# EAGLE design RF1_RS485 (EAGLE 7.1.0)
RS485/Renard adapter for the RF1
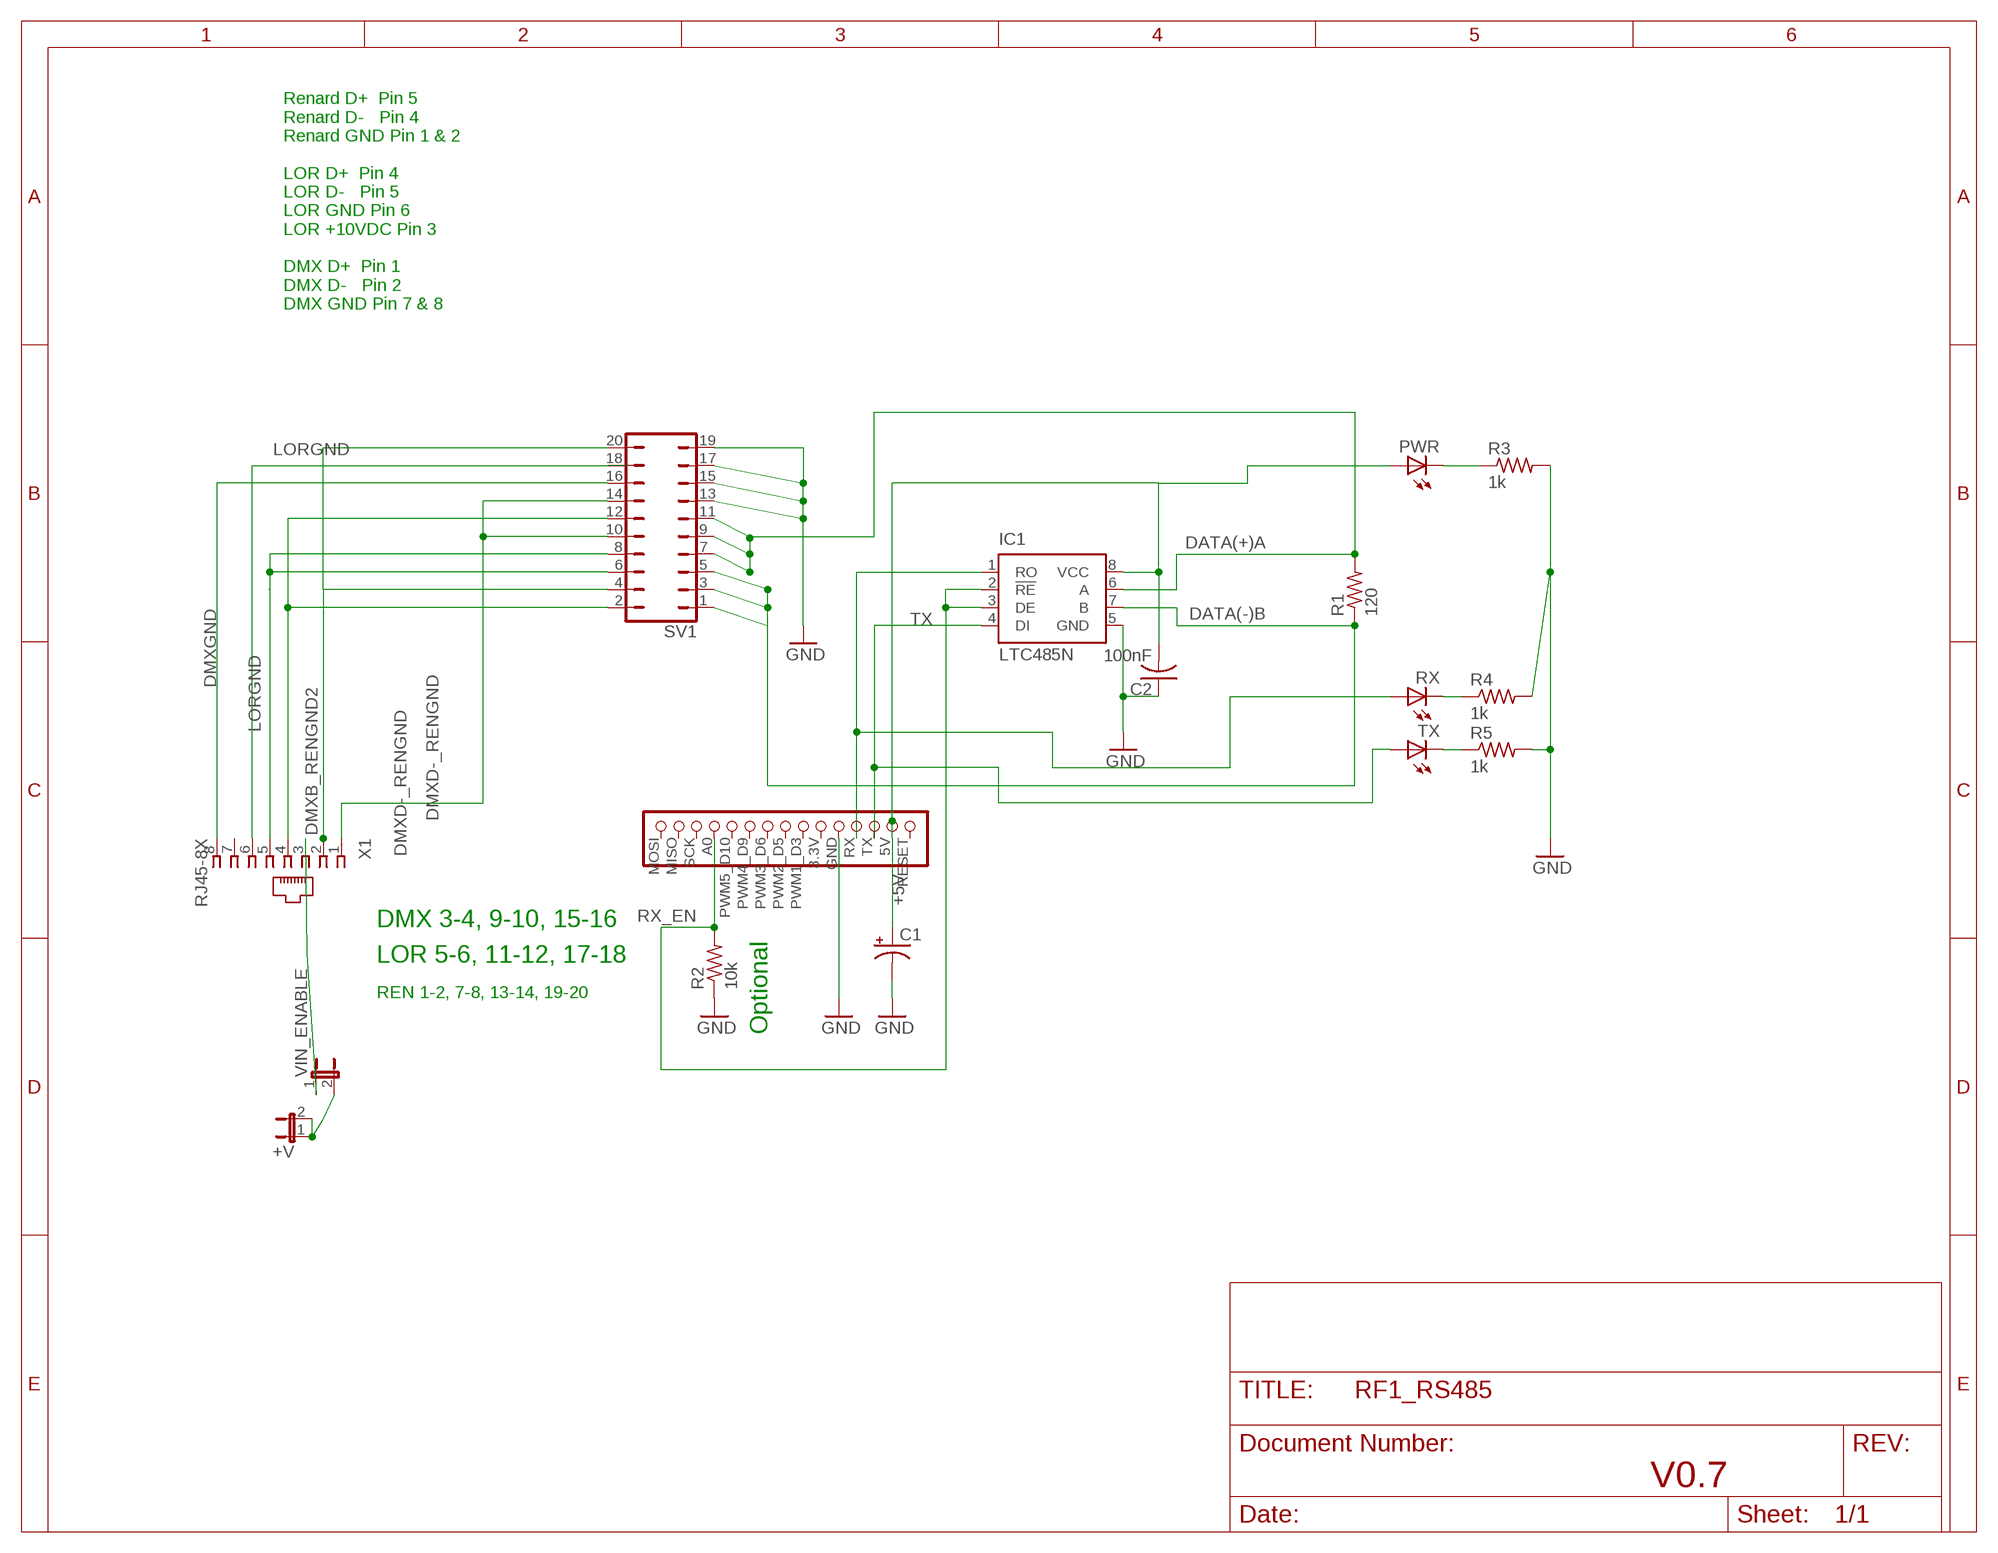
[diagram p0: schematic, sheet 1]

## Parts
+V  JP1E  [JP1]
C1  CPOL-USE5-5  [E5-5]
C2  100nF  C-US025-024X044  [C025-024X044]
IC1  LTC485N  [DIL08]
PWR  LED3MM  [LED3MM]
R1  120  R-US_0204/7  [0204/7]
R2  10k  R-US_0204/7  [0204/7]
R3  1k  R-US_0204/7  [0204/7]
R4  1k  R-US_0204/7  [0204/7]
R5  1k  R-US_0204/7  [0204/7]
RX  LED3MM  [LED3MM]
SV1  JP10Q  [JP10Q]
TX  LED3MM  [LED3MM]
U$1  RF1_HEADER_LEFT  [RF1_LEFTHEADER_ONLY]
VIN_ENABLE  JP1E  [JP1]
X1  RJ45-8X  [RJ45-NO-SHIELD]

## Nets
+5V: C1.+ C2.2 IC1.8(VCC) PWR.A U$1.5V
DATA(+)A: IC1.6(A) R1.2 SV1.7 SV1.9 SV1.11
DATA(-)B: IC1.7(B) R1.1 SV1.1 SV1.3 SV1.5
DMXB_RENGND2: SV1.4 SV1.20 X1.2
DMXD-_RENGND: SV1.10 SV1.14 X1.1
DMXGND: SV1.16 X1.8
GND: C1.- C2.1 IC1.5(GND) R2.1 R3.2 R4.2 R5.2 SV1.13 SV1.15 SV1.17 SV1.19 U$1.GND
LORGND: SV1.18 X1.6
N$1: SV1.6 SV1.8 X1.5
N$3: SV1.2 SV1.12 X1.4
N$5: VIN_ENABLE.1 X1.3
N$6: +V.1 +V.2 VIN_ENABLE.2
N$7: PWR.K(C) R3.1
N$8: R4.1 RX.K(C)
N$9: R5.1 TX.K(C)
RX: IC1.1(RO) RX.A U$1.RX
RX_EN: IC1.2(!RE) IC1.3(DE) R2.2 U$1.A0(PC0)
TX: IC1.4(DI) TX.A U$1.TX
Unconnected: U$1.3.3V U$1.MISO U$1.MOSI U$1.PWM1_D3(PWM1) U$1.PWM2_D5(PWM2) U$1.PWM3_D6(PWM3) U$1.PWM4_D9(PWM4) U$1.PWM5_D10(PWM5) U$1.RESET U$1.SCK X1.7

## Notes on the sheet
- Renard D+  Pin 5
  Renard D-   Pin 4
  Renard GND Pin 1 & 2
  
  LOR D+  Pin 4
  LOR D-   Pin 5
  LOR GND Pin 6
  LOR +10VDC Pin 3
  
  DMX D+  Pin 1
  DMX D-   Pin 2
  DMX GND Pin 7 & 8
- DMX 3-4, 9-10, 15-16
- LOR 5-6, 11-12, 17-18
- REN 1-2, 7-8, 13-14, 19-20
- Optional
- V0.7

## Library data of the parts
+V VIN_ENABLE = jumper:JP1E: JUMPER
C1 = adafruit:CPOL-US: POLARIZED CAPACITOR, American symbol
C2 = adafruit:C-US: CAPACITOR, American symbol
IC1 = linear-technology:LTC485: Low Power RS485 Interface Transceiver Source: http://www.linear.com/pc/downloadDocument.do?navId=H0,C1,C1007,C1017,P2064,D1718; OC_FARNELL: unknown; OC_NEWARK: unknown
PWR RX TX = adafruit:LED: LED OSRAM: - CHIPLED LG R971, LG N971, LY N971, LG Q971, LY Q971, LO R971, LY R971 LH N974, LH R974 LS Q976, LO Q976, LY Q976 LO Q996 - Hyper CHIPLED LW Q18S LB Q993, LB Q99A, LB R99A - SideLED LS A670, LO A670, LY A670, LG A670, LP A670 LB A673, LV A673, LT A673, LW A673 LH A674 LY A675 LS A676, LA A676, LO A676, LY A676, LW A676 LS A679, LY A679, LG A679 - Hyper Micro SIDELED® LS Y876, LA Y876, LO Y876, LY Y876 LT Y87S - SmartLED LW L88C, LW L88S LB L89C, LB L89S, LG L890 LS L89K, LO L89K, LY L89K LS L896, LA L896, LO L896, LY L896 - TOPLED LS T670, LO T670, LY T670, LG T670, LP T670 LSG T670, LSP T670, LSY T670, LOP T670, LYG T670 LG T671, LOG T671, LSG T671 LB T673, LV T673, LT T673, LW T673 LH T674 LS T676, LA T676, LO T676, LY T676, LB T676, LH T676, LSB T676, LW T676 LB T67C, LV T67C, LT T67C, LS T67K, LO T67K, LY T67K, LW E67C LS E67B, LA E67B, LO E67B, LY E67B, LB E67C, LV E67C, LT E67C LW T67C LS T679, LY T679, LG T679 LS T770, LO T770, LY T770, LG T770, LP T770 LB T773, LV T773, LT T773, LW T773 LH T774 LS E675, LA E675, LY E675, LS T675 LS T776, LA T776, LO T776, LY T776, LB T776 LHGB T686 LT T68C, LB T68C - Hyper Mini TOPLED® LB M676 - Mini TOPLED Santana® LG M470 LS M47K, LO M47K, LY M47K Source: http://www.osram.convergy.de/
R1-R5 = adafruit:R-US_: RESISTOR, American symbol
SV1 = jumper:JP10Q: JUMPER
U$1 = komby1:RF1_HEADER_LEFT
X1 = con-tycoelectronics_komby:RJ45: CORCOM Modular RJ Jacks No Shield Source: www.tycoelectronics.com .. ENG_DS_1654001_1099_RJ_L_0507.pdf; MPN: RJ45-8X; OC_FARNELL: unknown; OC_NEWARK: 16R6101

## Board
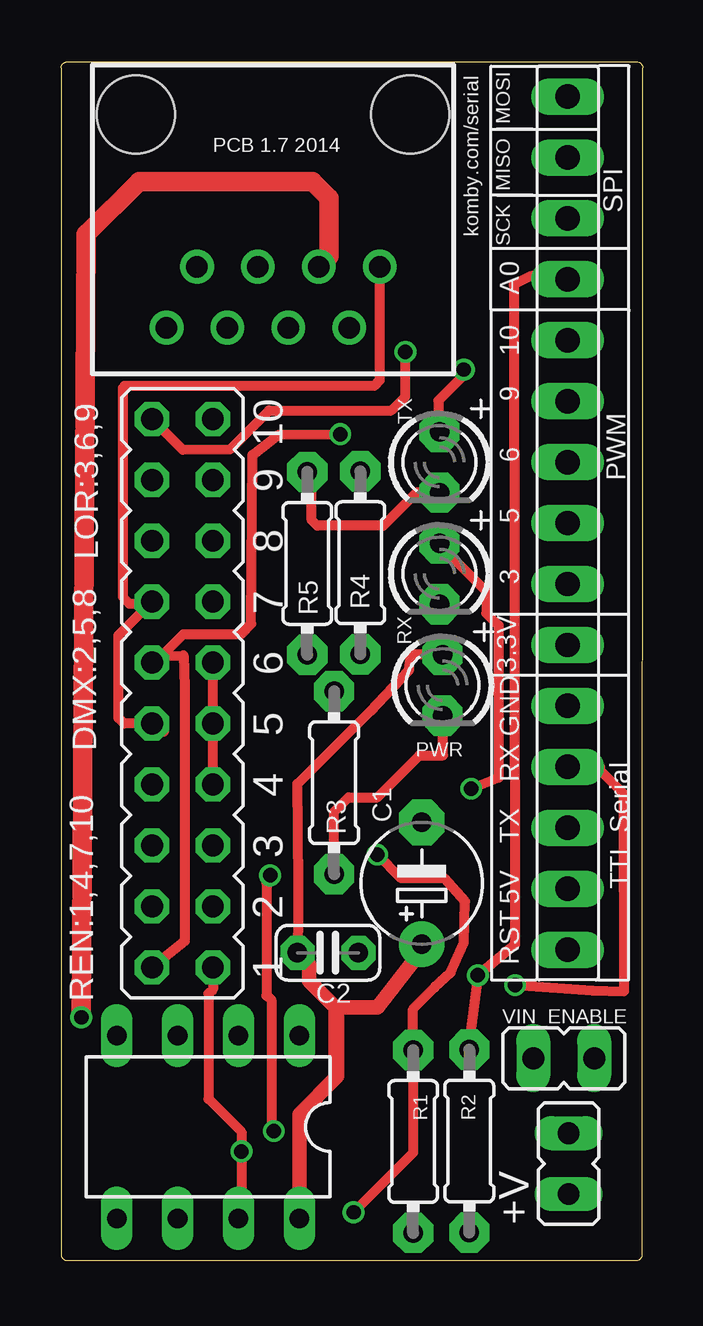
[diagram p1: board, top side]
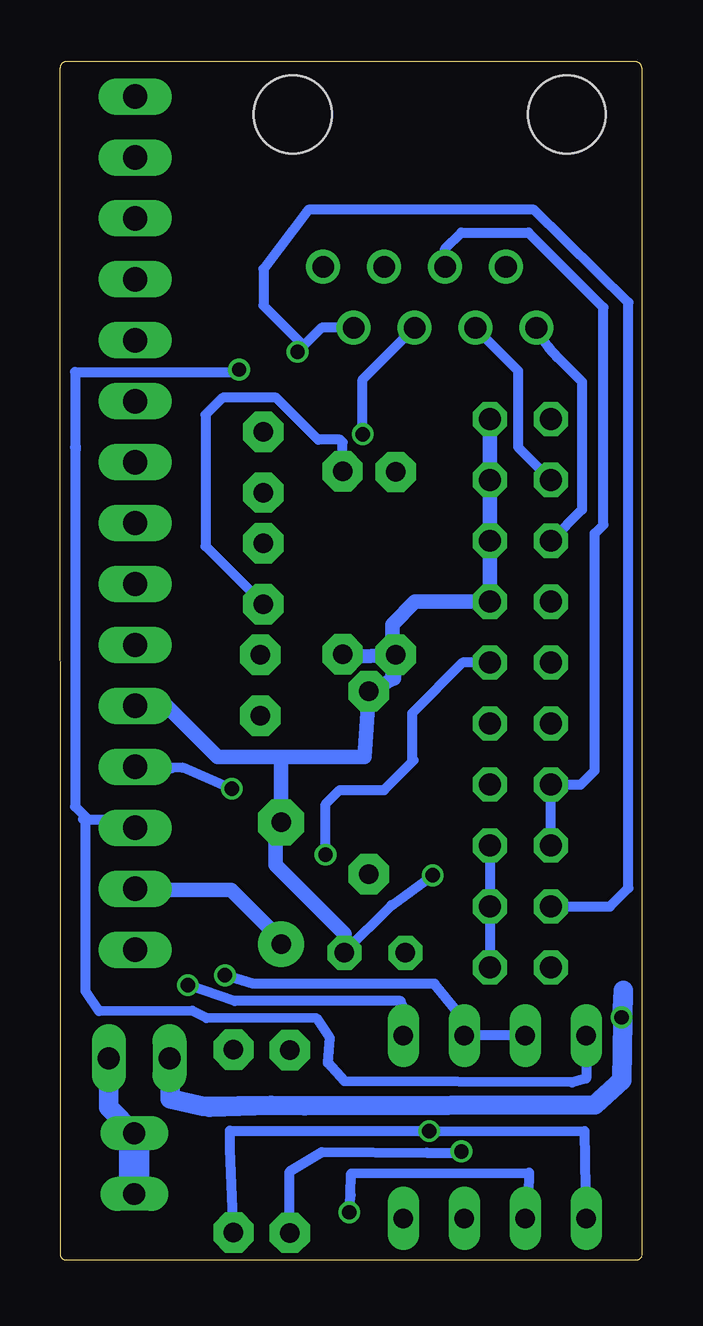
[diagram p2: board, bottom side, seen from below]

Size 24.26 x 49.96 mm. Coordinates in mm from the lower left corner, seen from the top.
Outline: 0,49.71 0,0.25 arc90 0.25,0 23.98,0 arc90 24.23,0.25 24.26,49.71 arc90 24,49.96 0.25,49.96 arc90 0,49.71
Copper layers (1*16): Top 0.035mm / dielectric 1.5mm / Bottom 0.035mm
Design rules "Elecrow_2-layer_eagle_rule": minimum track width 6mil, minimum drill 12mil, track to track 6mil, track to pad 6mil, pad to pad 6mil, via to via 6mil, smd to smd 0mil, copper to edge 10mil, drill to drill 10mil, minimum pad ring 10mil, minimum via ring 6mil, stop-mask expansion 2mil, vias tented up to drill 100mil, thermal gap 10mil

### Footprints (pad centres in the part's own frame; a part is rotated, then mirrored left to right if it is on the bottom)
JP1 = drill 0.914 long: 1 0,-1.27; 2 0,1.27
E5-5 = drill 0.813 pad 1.905: + -2.54,0 | drill 0.813 pad 1.905 octagon: - 2.54,0
C025-024X044 = drill 0.813 pad 1.422 octagon: 1 -1.27,0; 2 1.27,0
DIL08 = drill 0.813 long: 1 -3.81,-3.81; 2 -1.27,-3.81; 3 1.27,-3.81; 4 3.81,-3.81; 5 3.81,3.81; 6 1.27,3.81; 7 -1.27,3.81; 8 -3.81,3.81
LED3MM = drill 0.813 pad 1.676 octagon: A -1.27,0; K 1.27,0
0204/7 = drill 0.813 pad 1.676 octagon: 1 -3.81,0; 2 3.81,0
JP10Q = drill 0.914 octagon: 1 -11.43,-1.27; 2 -11.43,1.27; 3 -8.89,-1.27; 4 -8.89,1.27; 5 -6.35,-1.27; 6 -6.35,1.27; 7 -3.81,-1.27; 8 -3.81,1.27; 9 -1.27,-1.27; 10 -1.27,1.27; 11 1.27,-1.27; 12 1.27,1.27; 13 3.81,-1.27; 14 3.81,1.27; 15 6.35,-1.27; 16 6.35,1.27; 17 8.89,-1.27; 18 8.89,1.27; 19 11.43,-1.27; 20 11.43,1.27
RF1_LEFTHEADER_ONLY = drill 1.016 long: 3.3V 1.42,-5.215; 5V 1.42,-15.375; A0 1.42,10.025; GND 1.42,-7.755; MISO 1.42,15.105; MOSI 1.42,17.645; PWM1_D3 1.42,-2.675; PWM2_D5 1.42,-0.135; PWM3_D6 1.42,2.405; PWM4_D9 1.42,4.945; PWM5_D10 1.42,7.485; RESET 1.42,-17.915; RX 1.42,-10.295; SCK 1.42,12.565; TX 1.42,-12.835
RJ45-NO-SHIELD = drill 0.9 pad 1.4: 1 -4.445,6.35; 2 -3.175,8.89; 3 -1.905,6.35; 4 -0.635,8.89; 5 0.635,6.35; 6 1.905,8.89; 7 3.175,6.35; 8 4.445,8.89 | hole 3.251: -5.715,0; 5.715,0

### Placement (x,y rotation side)
+V  21.16,4.04 0 top
C1  15.04,15.72 90 top
C2  11.13,12.83 180 top
IC1  6.13,5.57 180 top
PWR  15.9,23.98 270 top
R1  14.68,4.96 90 top
R2  17.02,4.98 90 top
R3  11.38,19.91 90 top
R4  12.47,29.08 270 top
R5  10.26,29.06 270 top
RX  15.77,28.63 270 top
SV1  5.05,23.65 90 top
TX  15.77,33.27 270 top
U$1  19.7,30.87 0 top
VIN_ENABLE  20.95,8.43 270 top
X1  8.84,47.77 180 top

### Tracks (layer width: path | path; a pad name or v marks a point on that pad's centre or on a via)
+5V
  Top 0.406: C2.2 9.88,14.5 9.86,18.95 9.86,19.86 12.88,22.89 14.5,24.61 14.55,25.07 14.55,25.12 14.71,25.27 15.88,25.27 PWR.A
  Top 0.61: C1.+ 14.91,13.18 14.91,12.72 14.86,12.7 13.18,10.54 11.43,10.54 11.43,8.28 11.48,9.07 11.51,10.49 | IC1.8 9.94,6.1 11.51,7.67 11.51,10.49 | 11.51,10.49 10.34,11.66 10.34,12.34 C2.2
  Bottom 0.61: C1.+ 15.04,13.36 17.12,15.44 21.07,15.44 U$1.5V
DATA(+)A  (via drill 0.6)
  Top 0.406: SV1.7 SV1.9 SV1.11 | v12.19,2.01 14.68,4.49 R1.2 14.68,10.48 15.57,11.38 16.23,11.99 16.79,13.23 16.84,14.96 15.98,15.93 14.17,15.93 v13.18,16.92
  Bottom 0.406: v12.19,2.01 12.14,2.72 12.12,3.63 4.7,3.66 4.75,1.86 IC1.6 | SV1.11 7.47,24.92 9.58,22.81 9.58,20.93 9.5,20.85 10.74,19.61 12.6,19.61 13.18,19.02 v13.18,16.92
DATA(-)B  (via drill 0.6)
  Top 0.406: SV1.1 6.33,11.3 6.15,11.12 6.15,6.73 7.52,5.36 v7.52,4.55 7.52,1.88 IC1.7
  Bottom 0.406: SV1.5 SV1.3 SV1.1 | R1.1 14.68,3.71 13.34,4.52 8.97,4.5 7.57,4.5 v7.52,4.55
DMXB_RENGND2  (via drill 0.6)
  Top 0.406: SV1.20 5.08,33.78 7.04,33.81 8.66,35.43 13.77,35.43 14.35,36.02 v14.35,37.87
  Bottom 0.406: X1.2 13.34,38.88 14.1,38.12 | SV1.4 1.32,14.76 0.56,15.52 0.56,39.93 4.5,43.79 13.89,43.79 15.77,41.33 15.77,39.8 14.1,38.12 | v14.35,37.87 14.1,38.12
DMXD-_RENGND
  Top 0.406: 4.29,22.05 SV1.10 2.62,22.38 2.39,22.61 2.39,26.06 SV1.14 3.71,27.38 2.85,27.38 2.56,27.66 2.56,36.37 2.64,36.45 13.06,36.45 13.28,36.68 X1.1
DMXGND
  Bottom 0.406: X1.8 4.39,38.74 3.89,38.08 3.48,37.62 2.49,36.63 2.49,31.29 SV1.16
GND  (via drill 0.6)
  Top 0.406: v8.71,16.05 8.66,16.08 8.56,15.75 8.56,11.05 8.64,10.97 8.66,10.97 8.76,10.87 8.76,5.5 v8.87,5.4
  Bottom 0.406: R2.1 17.17,4.62 17.17,5.41 v8.87,5.4 | v8.87,5.4 2.39,5.38 2.34,1.78 IC1.5 | C2.1 12.39,12.85 10.44,14.81 10.41,14.81 v8.71,16.05 | v8.87,5.4 9.12,5.4
  Bottom 0.61: SV1.19 SV1.17 SV1.15 SV1.13 9.45,27.46 10.39,26.52 10.39,24.46 R5.2 | U$1.GND 19.81,23.11 17.68,20.98 15.19,20.98 | 15.19,20.98 11.56,20.98 R3.2 10.34,24.26 R5.2 | R5.2 12.32,25.15 R4.2 | 15.19,20.98 15.04,20.83 C1.- 15.27,18.03 15.27,16.48 12.39,13.61 C2.1
LORGND
  Bottom 0.406: X1.6 6.93,38.86 5.16,37.08 5.16,33.91 SV1.18
N$1
  Bottom 0.406: SV1.6 SV1.8 2.54,19.84 1.96,20.42 1.96,30.3 1.6,30.66 1.6,39.73 4.72,42.85 7.52,42.85 8.2,42.17 X1.5
N$3  (via drill 0.6)
  Top 0.406: SV1.12 3.68,24.64 | 3.68,24.64 3.83,25.2 5.11,25.22 5.16,23.9 5.16,13.31 SV1.2 | 3.68,24.64 3.68,24.69 5.11,26.11 7.49,26.11 7.92,26.54 7.98,33.58 9.07,34.42 v11.63,34.44
  Bottom 0.406: v11.63,34.44 11.63,36.72 X1.4
N$5  (via drill 0.6)
  Top 0.813: X1.3 11.18,41.85 11.18,44.27 10.49,44.96 3.25,44.96 1.09,42.82 1.04,42.77 v0.84,10.13
  Bottom 0.813: VIN_ENABLE.1 19.68,7.8 19.66,6.73 18.29,6.43 15.45,6.46 | 15.45,6.46 18.01,6.38 | v0.84,10.13 0.76,11.25 0.84,7.52 1.96,6.48 14.06,6.45 15.45,6.46
N$6
  Bottom 0.813: VIN_ENABLE.2 22.23,6.38 +V.2
  Bottom 1.27: +V.1 +V.2
N$7
  Top 0.406: R3.1 11.38,18.69 11.99,19.3 13.18,19.3 14.94,21.06 15.93,21.06 15.93,22.68 PWR.K
N$8
  Bottom 0.406: R4.1 12.47,34.11 12.57,34.21 13.49,34.21 15.24,35.97 17.48,35.97 18.19,35.26 18.19,29.77 RX.K
N$9
  Top 0.406: TX.K 14.81,32 13.44,30.63 10.67,30.63 10.44,30.86 10.44,32.69 R5.1
RX  (via drill 0.6)
  Top 0.406: v18.92,11.48 22.15,11.25 23.47,11.23 23.44,19.46 22.32,20.57 U$1.RX 22.48,20.57 | RX.A 15.77,29.84 17.73,27.89 17.73,26.98 18.24,26.47 18.24,20.12 v17.09,19.66
  Bottom 0.406: IC1.1 9.94,10.57 10.06,10.82 16.97,10.82 v18.92,11.48 | v17.09,19.66 19.15,20.55 19.58,20.52 21.07,20.52 U$1.RX
RX_EN  (via drill 0.6)
  Top 0.406: R2.2 17.04,9.35 v17.37,11.89 18.92,13.16 18.87,40.66 19.64,41.05 U$1.A0
  Bottom 0.406: IC1.3 IC1.2 7.39,10.01 8.64,11.53 16.2,11.53 v17.37,11.89
TX  (via drill 0.6)
  Top 0.406: v16.79,37.13 16.79,36.91 15.72,35.84 15.72,34.59 TX.A
  Bottom 0.406: IC1.4 2.31,7.59 2.9,7.42 12.39,7.47 13.08,8.23 13.01,9.27 13.54,10.08 18.16,10.11 18.75,10.41 22.63,10.39 23.19,11.23 23.19,18.29 23.29,18.39 23.09,18.39 | 23.09,18.39 21.48,18.39 U$1.TX | 23.09,18.39 23.62,18.92 23.62,33.88 23.6,33.91 | 23.6,33.81 23.6,33.91 | 23.6,33.91 23.6,36.96 23.62,37.03 16.89,37.03 v16.79,37.13

### Text on the board
tNames: komby.com/serial | PCB 1.7 2014 | LOR:3,6,9 | DMX:2,5,8 | REN:1,4,7,10